# Altium schematic sheet GPIO.SchDoc: APTOMAT - Power Supply
size A3; Revision: 1.1.1; SheetNumber: 5; SheetTotal: 5; DrawnBy: KJP; ProjectNumber: 4397; PCBRevision: 0071KJP; DocumentSize: A4; PCAName: PCA10040; PCBNumber: 400150; ProjectName: Quark
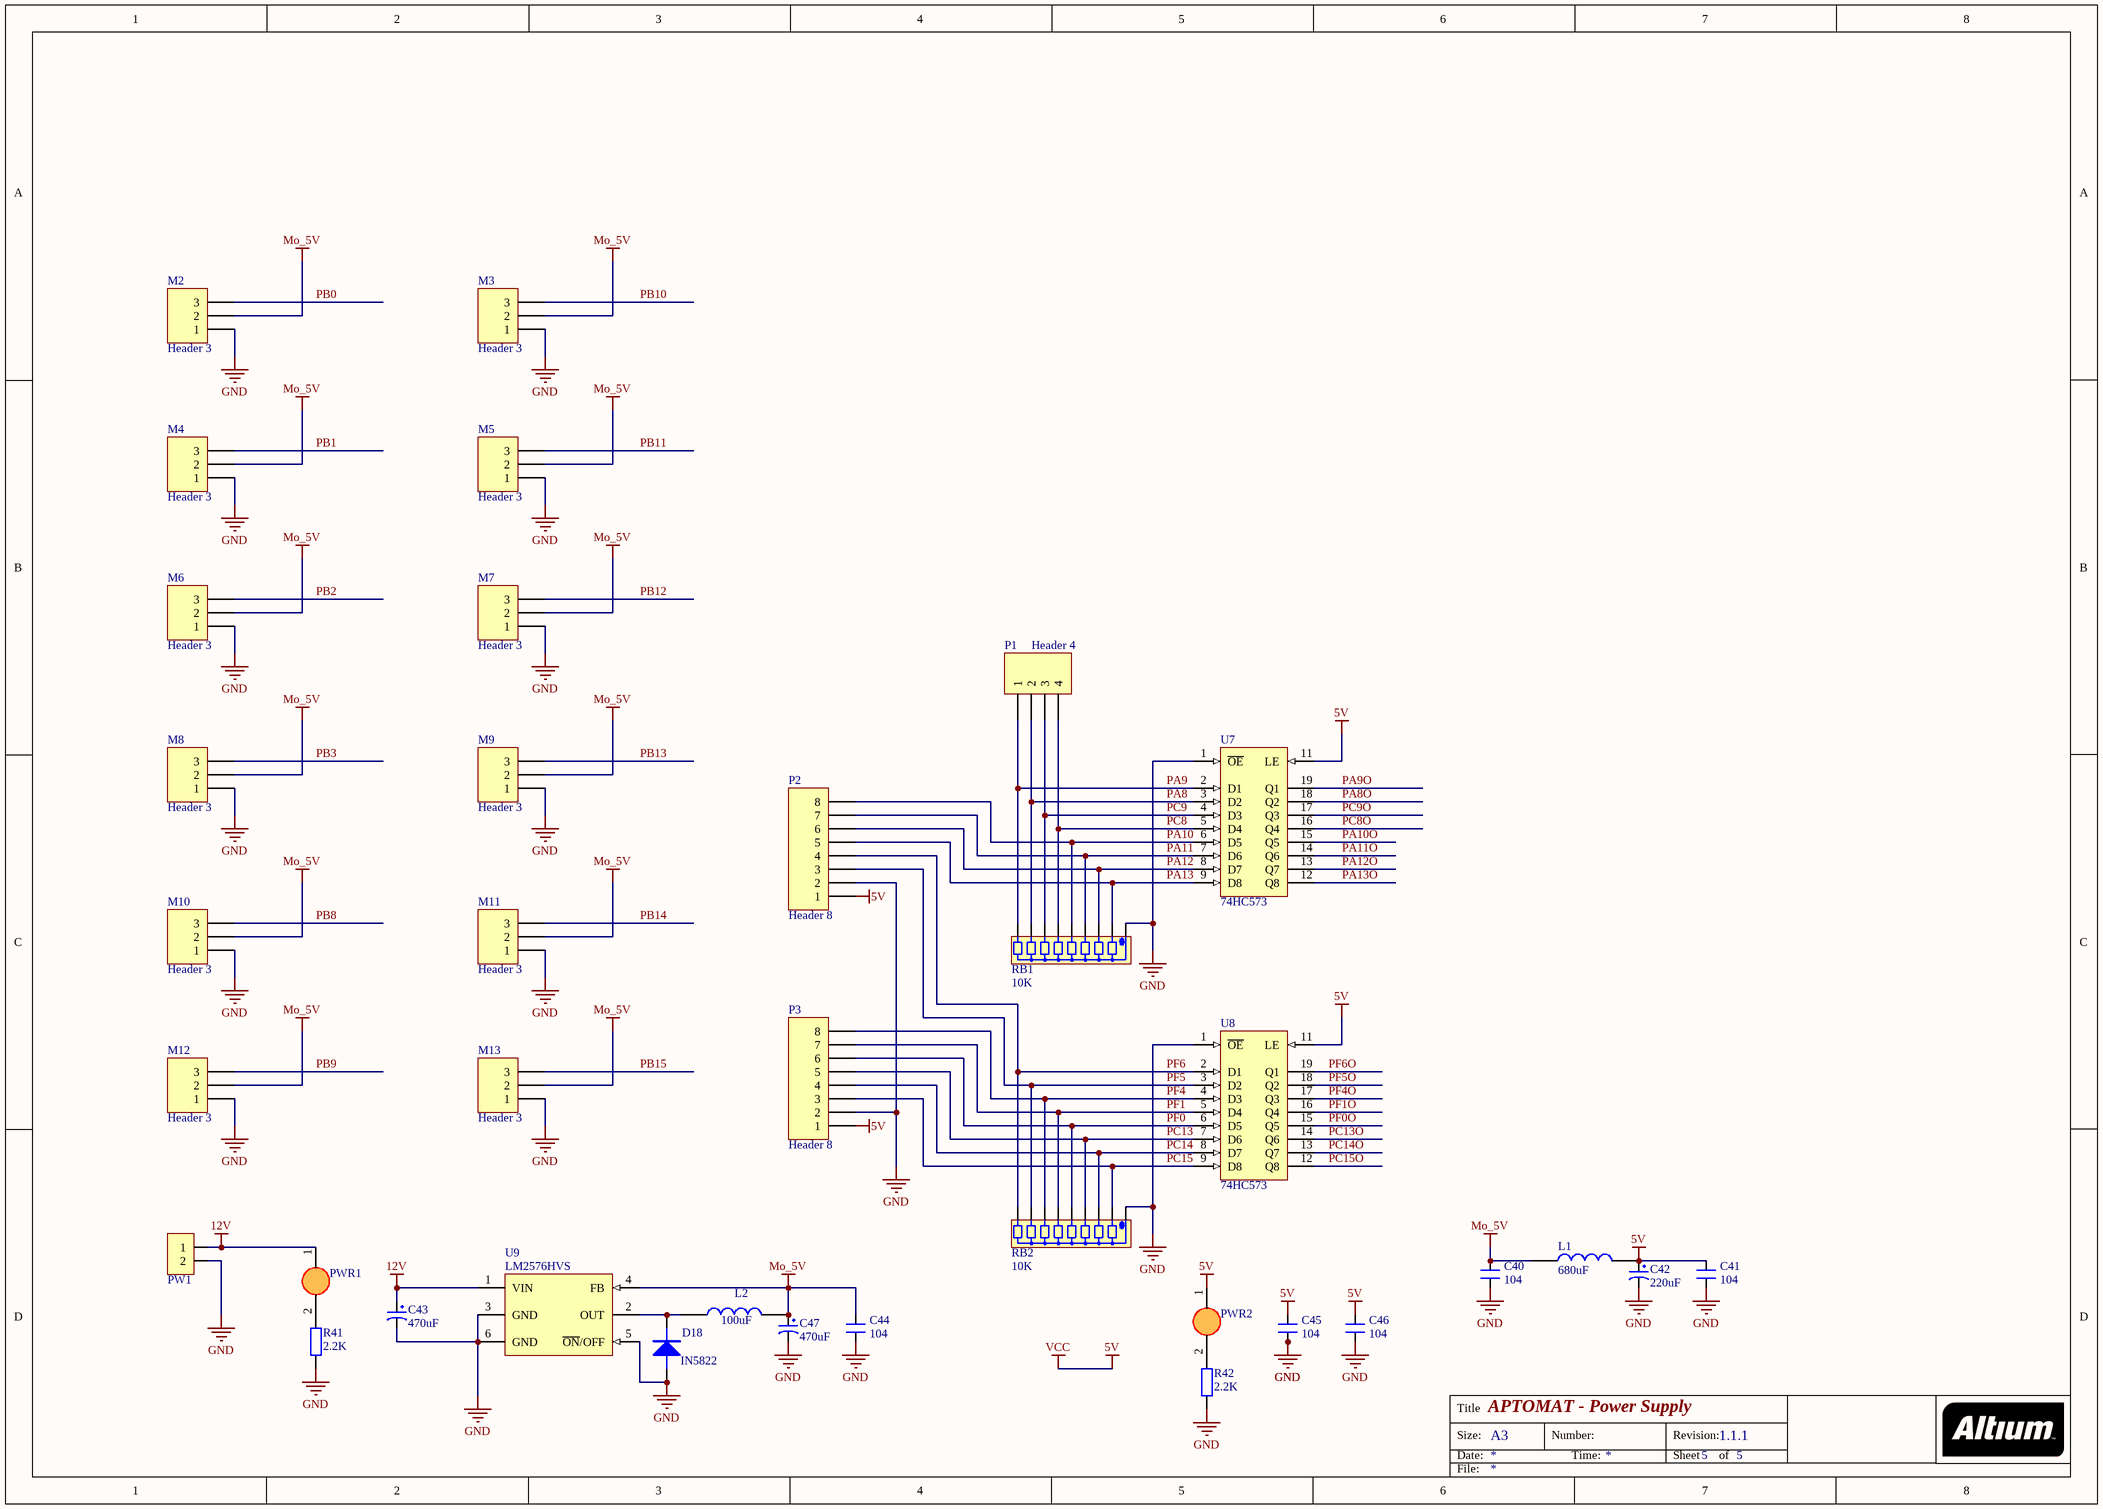
[diagram p0: GPIO.SchDoc]

## Parts
C40  104  [0805_HV]
C41  104  [0805_HV]
C42  220uF  [TU_NHOM_2.5_MH]
C43  470uF  [TU_NHOM_470uF_25V_MH]
C44  104  [0805_HV]
C45  104  [0805_HV]
C46  104  [0805_HV]
C47  470uF  [TU_NHOM_470uF_25V_MH]
D18  IN5822  [SOD123]
L1  680uF  [Inductor 4.5x5]
L2  100uF  [IND_2118-V-RC]
M2  Header 3  [HDR1X3]
M3  Header 3  [HDR1X3]
M4  Header 3  [HDR1X3]
M5  Header 3  [HDR1X3]
M6  Header 3  [HDR1X3]
M7  Header 3  [HDR1X3]
M8  Header 3  [HDR1X3]
M9  Header 3  [HDR1X3]
M10  Header 3  [HDR1X3]
M11  Header 3  [HDR1X3]
M12  Header 3  [HDR1X3]
M13  Header 3  [HDR1X3]
P1  Header 4  [HDR1X4]
P2  Header 8  [HEADER2M_8P]
P3  Header 8  [HEADER2M_8P]
PW1  CON 2 EDG 5.08_MH  [CON 2 EDG 5.08]  (value not drawn)
PWR1  LED3  [LED_0805]  (value not drawn)
PWR2  LED3  [LED_0805]  (value not drawn)
R41  2.2K  [Tro SMD 0805]
R42  2.2K  [Tro SMD 0805]
RB1  TRO_BANG_A09_MH  [TRO_BANG_A09]  (value not drawn)
RB2  TRO_BANG_A09_MH  [TRO_BANG_A09]  (value not drawn)
U7  74HC573  [DIP20]
U8  74HC573  [DIP20]
U9  LM2576HVS  [TO263-5]

## Nets
5V: C41.2 C42.1 C45.2 C46.2 L1.2 P2.1 P3.1 PWR2.1(A) U7.11(LE) U7.20(VCC) U8.11(LE) U8.20(VCC)  [also labelled VCC]
12V: C43.1 PW1.1 PWR1.1(A) U9.1(VIN)
GND: C40.1 C41.1 C42.2 C43.2 C44.1 C45.1 C46.1 C47.2 D18.1 M2.1 M3.1 M4.1 M5.1 M6.1 M7.1 M8.1 M9.1 M10.1 M11.1 M12.1 M13.1 P2.2 P3.2 PW1.2 R41.1 R42.1 RB1.1 RB2.1 U7.1(~{OE}) U7.10(GND) U8.1(~{OE}) U8.10(GND) U9.3(GND) U9.5(~{ON}/OFF) U9.6(GND)
Mo_5V: C40.2 C44.2 C47.1 L1.1 L2.2 M2.2 M3.2 M4.2 M5.2 M6.2 M7.2 M8.2 M9.2 M10.2 M11.2 M12.2 M13.2 U9.4(FB)
PA8: P1.2 RB1.8 U7.3(D2)
PA8O: U7.18(Q2)
PA9: P1.1 RB1.9 U7.2(D1)
PA9O: U7.19(Q1)
PA10: P2.8 RB1.5 U7.6(D5)
PA10O: U7.15(Q5)
PA11: P2.7 RB1.4 U7.7(D6)
PA11O: U7.14(Q6)
PA12: P2.6 RB1.3 U7.8(D7)
PA12O: U7.13(Q7)
PA13: P2.5 RB1.2 U7.9(D8)
PA13O: U7.12(Q8)
PB0: M2.3
PB1: M4.3
PB2: M6.3
PB3: M8.3
PB8: M10.3
PB9: M12.3
PB10: M3.3
PB11: M5.3
PB12: M7.3
PB13: M9.3
PB14: M11.3
PB15: M13.3
PC8: P1.4 RB1.6 U7.5(D4)
PC8O: U7.16(Q4)
PC9: P1.3 RB1.7 U7.4(D3)
PC9O: U7.17(Q3)
PC13: P3.5 RB2.4 U8.7(D6)
PC13O: U8.14(Q6)
PC14: P3.4 RB2.3 U8.8(D7)
PC14O: U8.13(Q7)
PC15: P3.3 RB2.2 U8.9(D8)
PC15O: U8.12(Q8)
PF0: P3.6 RB2.5 U8.6(D5)
PF0O: U8.15(Q5)
PF1: P3.7 RB2.6 U8.5(D4)
PF1O: U8.16(Q4)
PF4: P3.8 RB2.7 U8.4(D3)
PF4O: U8.17(Q3)
PF5: P2.3 RB2.8 U8.3(D2)
PF5O: U8.18(Q2)
PF6: P2.4 RB2.9 U8.2(D1)
PF6O: U8.19(Q1)
NetD18_2: D18.2 L2.1 U9.2(OUT)
NetPWR1_2: PWR1.2(K) R41.2
NetPWR2_2: PWR2.2(K) R42.2

## Notes on the sheet
- Title
- Size:
- Date:
- A3
- Number:
- Time:
- Revision:
- Sheet
- of
- File:
- (in symbol TRO_BANG_A09_MH) 10K

## Library data of the parts
C40 C41 C44-C46 = CM: Cap SMD; Value: 103
C42 = TU_NHOM_220uF_25V_MH: LINK: https://item.taobao.com/item.htm?spm=a230r.1.14.282.6c612953FsebRk&id=546158429968&ns=1&abbucket=10#detail
C43 C47 = TU_NHOM_470uF_25V_MH: Value: 47uF/16 - 50V; Description 1: 470uF/6,3V - 330uF/10V - 220uF/16V; Description 2: 100uF/25V - 35V - 47uF/50V - 22uF/100V; Description 3: 33uF => 47uF/63V - 1uF => 4,7uF/160V; Description 4: 1uF => 2,2uF/250V - 1uF/350V
D18 = Diode S4 SOD123 ( 1N5819 SOD123)_MH: Diode S4 SOD123 ( 1N5819 SOD123)
L1 = Inductor 4.5x5_MH
L2 = Inductor Lm2576_MH: cuon cam
M2-M13 = Header 3: Header, 3-Pin; LatestRevisionDate: 17-Jul-2002; LatestRevisionNote: Re-released for DXP Platform.; Publisher: Altium Limited
P1 = Header 4: Header, 4-Pin; LatestRevisionDate: 17-Jul-2002; LatestRevisionNote: Re-released for DXP Platform.; Publisher: Altium Limited
P2 P3 = Header 8: Header, 8-Pin; LatestRevisionDate: 17-Jul-2002; LatestRevisionNote: Re-released for DXP Platform.; Publisher: Altium Limited
PW1 = CON 2 EDG 5.08_MH: CON 2 EDG 5.08 (xanh cong)
PWR1 PWR2 = LED SMD_0805_MH: LED 3mm
R41 R42 = TRO_SMD_0805_MH
U7 U8 = 74HC573 DIP20 IC Flip-Flop_MH: Octal D-Type Latch with 3-State Output Non-Inverting; Value: 74HC573; Copyright by: VanDungEvn@Gmail.com
U9 = LM2576HVS-5.0V BUCK 5V 3A TO263-5 _MH: PartNumber: LM2576T-5.0; Manufacturer: National Semiconductor; CompType: Switcher; PackageTopMarking: NSUZXYTT*LM2576T*-5.0 P+; PowerWise: N; FirstPublished: 4-Dec-2008; DatasheetVersion: Aug-2004; PackageVersion: revJ, Jan-1992; PackageReference: T05A; Publisher: Altium Limited; PackageDescription: TO-220, Molded, 5 Lead, Straight; RoHS: O; PinCount: 5; DigiKeyPartNumber: LM2576T-5.0-ND; Code_JEDEC: TO-220-AB; ComponentLink1Description: LM2576 Datasheet; ComponentLink1URL: http://www.national.com/ds/LM/LM2576.pdf; ComponentLink2Description: LM2576 Web Page; ComponentLink2URL: http://www.national.com/pf/LM/LM2576.html; ComponentLink3Description: T05A Package Page; ComponentLink3URL: http://www.national.com/packaging/folders/t05a.html